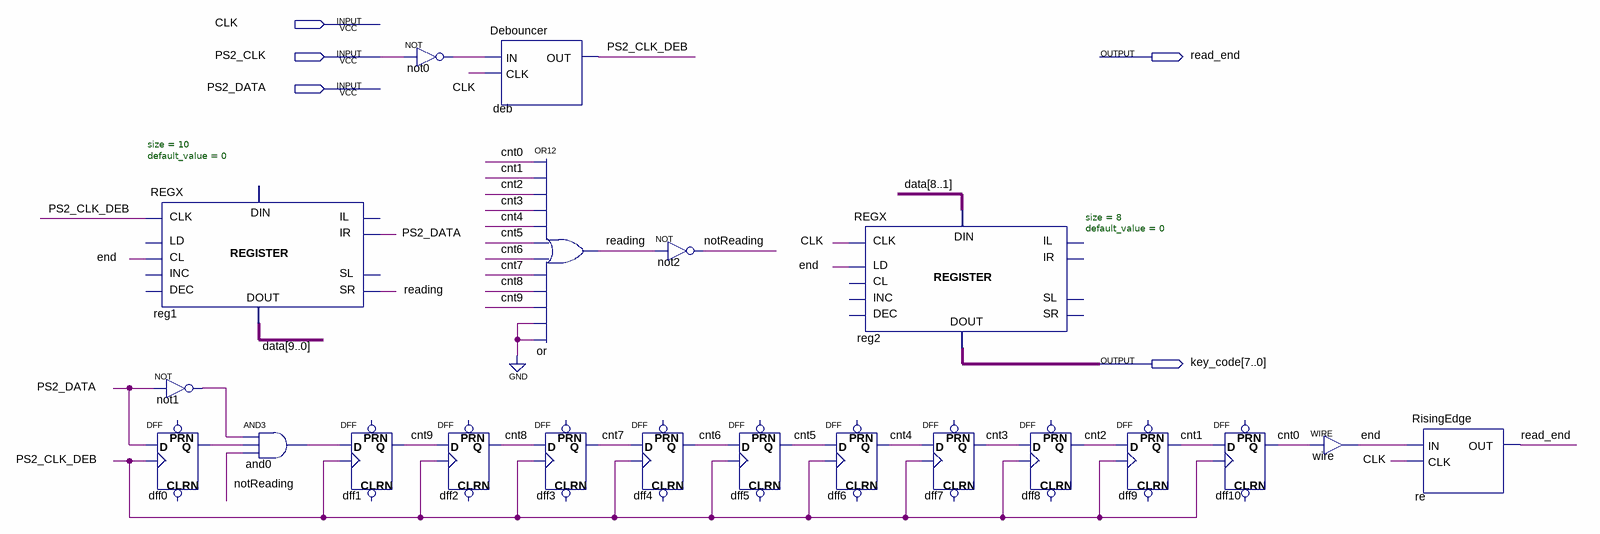
[diagram p0: schematic sheet]
// Quartus schematic KeyboardInterface.bdf as structural Verilog: 21 symbols, 5 pins
module KeyboardInterface (
  input  CLK,
  input  PS2_CLK,
  input  PS2_DATA,
  output read_end,
  output [7:0] key_code
);

  wire and0_out, cnt0, cnt1, cnt2, cnt3, cnt4, cnt5, cnt6, cnt7, cnt8, cnt9, dff0_q, \end , not0_out,
       not1_out, notReading, PS2_CLK_DEB, reading;
  wire [9:0] data;

  REGX #(.size(10), .default_value(0)) reg1 (
    .clk(PS2_CLK_DEB), .cl(\end ), .ir(PS2_DATA), .sr(reading), .data_out(data));  // open: data_in, ld, inc, dec, il, sl
  not not1 (not1_out, PS2_DATA);
  DFF dff0 (.CLK(PS2_CLK_DEB), .D(PS2_DATA), .Q(dff0_q));  // open: CLRN, PRN
  and and0 (and0_out, not1_out, dff0_q, notReading);
  DFF dff1 (.CLK(PS2_CLK_DEB), .D(and0_out), .Q(cnt9));  // open: CLRN, PRN
  not not0 (not0_out, PS2_CLK);
  Debouncer deb (.IN(not0_out), .CLK(CLK), .OUT(PS2_CLK_DEB));
  DFF dff2 (.CLK(PS2_CLK_DEB), .D(cnt9), .Q(cnt8));  // open: CLRN, PRN
  or \or  (reading, cnt0, cnt1, cnt2, cnt3, cnt4, cnt5, cnt6, cnt7, cnt8, cnt9, 1'b0, 1'b0);
  DFF dff3 (.CLK(PS2_CLK_DEB), .D(cnt8), .Q(cnt7));  // open: CLRN, PRN
  not not2 (notReading, reading);
  DFF dff4 (.CLK(PS2_CLK_DEB), .D(cnt7), .Q(cnt6));  // open: CLRN, PRN
  DFF dff5 (.CLK(PS2_CLK_DEB), .D(cnt6), .Q(cnt5));  // open: CLRN, PRN
  REGX #(.size(8), .default_value(0)) reg2 (
    .data_in(data[8:1]), .clk(CLK), .ld(\end ), .data_out(key_code));  // open: cl, inc, dec, il, ir, sl, sr
  DFF dff6 (.CLK(PS2_CLK_DEB), .D(cnt5), .Q(cnt4));  // open: CLRN, PRN
  DFF dff7 (.CLK(PS2_CLK_DEB), .D(cnt4), .Q(cnt3));  // open: CLRN, PRN
  DFF dff8 (.CLK(PS2_CLK_DEB), .D(cnt3), .Q(cnt2));  // open: CLRN, PRN
  DFF dff9 (.CLK(PS2_CLK_DEB), .D(cnt2), .Q(cnt1));  // open: CLRN, PRN
  DFF dff10 (.CLK(PS2_CLK_DEB), .D(cnt1), .Q(cnt0));  // open: CLRN, PRN
  assign \end  = cnt0;  // WIRE wire
  RisingEdge re (.IN(\end ), .CLK(CLK), .OUT(read_end));
endmodule
